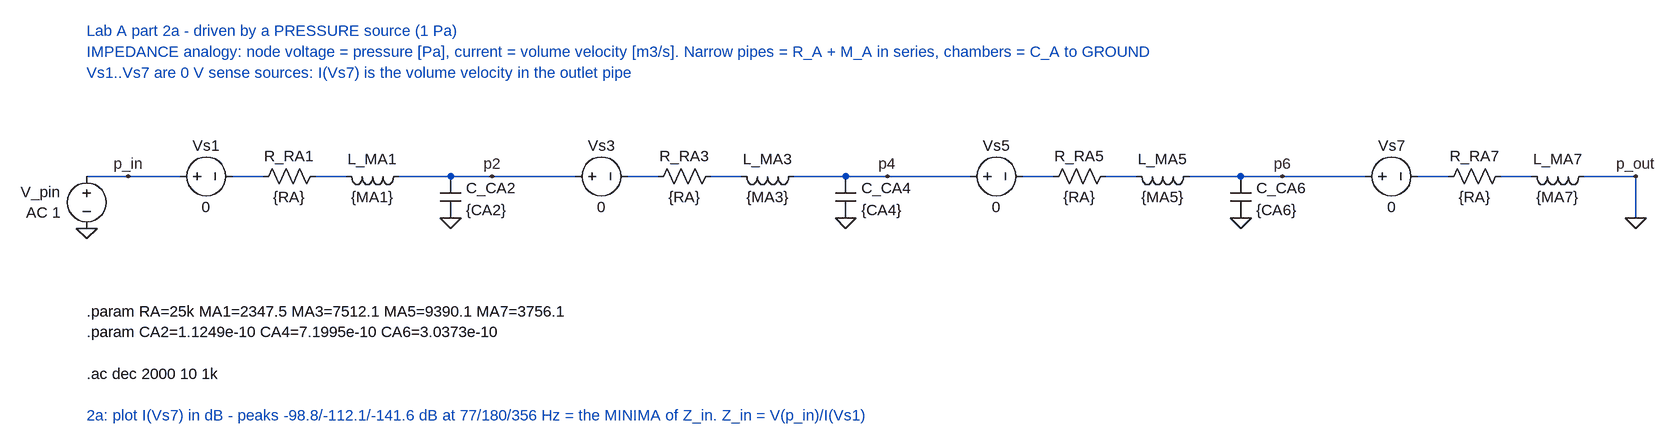
[diagram p0: schematic Part2a_Silencer_PressureSource.asc]
Part2a_Silencer_PressureSource.asc, the LTspice schematic file:
Version 4
SHEET 1 3000 1600
WIRE 0 0 144 0
WIRE 224 0 272 0
WIRE 352 0 400 0
WIRE 480 0 752 0
WIRE 832 0 880 0
WIRE 960 0 1008 0
WIRE 1088 0 1360 0
WIRE 1440 0 1488 0
WIRE 1568 0 1616 0
WIRE 1696 0 1968 0
WIRE 2048 0 2096 0
WIRE 2176 0 2224 0
WIRE 2304 0 2384 0
WIRE 2384 0 2384 64
FLAG 0 80 0
FLAG 64 0 p_in
FLAG 560 64 0
FLAG 624 0 p2
FLAG 1168 64 0
FLAG 1232 0 p4
FLAG 1776 64 0
FLAG 1840 0 p6
FLAG 2384 0 p_out
FLAG 2384 64 0
SYMBOL voltage 0 -16 R0
WINDOW 0 -40 40 Right 2
WINDOW 3 -40 72 Right 2
SYMATTR InstName V_pin
SYMATTR Value AC 1
SYMBOL voltage 128 0 R270
WINDOW 0 32 56 VTop 2
WINDOW 3 -32 56 VBottom 2
SYMATTR InstName Vs1
SYMATTR Value 0
SYMBOL res 368 -16 R90
WINDOW 0 0 56 VBottom 2
WINDOW 3 32 56 VTop 2
SYMATTR InstName R_RA1
SYMATTR Value {RA}
SYMBOL ind 496 -16 R90
WINDOW 0 5 56 VBottom 2
WINDOW 3 32 56 VTop 2
SYMATTR InstName L_MA1
SYMATTR Value {MA1}
SYMATTR SpiceLine Rser=0
SYMBOL cap 544 0 R0
WINDOW 0 40 18 Left 2
WINDOW 3 40 52 Left 2
SYMATTR InstName C_CA2
SYMATTR Value {CA2}
SYMBOL voltage 736 0 R270
WINDOW 0 32 56 VTop 2
WINDOW 3 -32 56 VBottom 2
SYMATTR InstName Vs3
SYMATTR Value 0
SYMBOL res 976 -16 R90
WINDOW 0 0 56 VBottom 2
WINDOW 3 32 56 VTop 2
SYMATTR InstName R_RA3
SYMATTR Value {RA}
SYMBOL ind 1104 -16 R90
WINDOW 0 5 56 VBottom 2
WINDOW 3 32 56 VTop 2
SYMATTR InstName L_MA3
SYMATTR Value {MA3}
SYMATTR SpiceLine Rser=0
SYMBOL cap 1152 0 R0
WINDOW 0 40 18 Left 2
WINDOW 3 40 52 Left 2
SYMATTR InstName C_CA4
SYMATTR Value {CA4}
SYMBOL voltage 1344 0 R270
WINDOW 0 32 56 VTop 2
WINDOW 3 -32 56 VBottom 2
SYMATTR InstName Vs5
SYMATTR Value 0
SYMBOL res 1584 -16 R90
WINDOW 0 0 56 VBottom 2
WINDOW 3 32 56 VTop 2
SYMATTR InstName R_RA5
SYMATTR Value {RA}
SYMBOL ind 1712 -16 R90
WINDOW 0 5 56 VBottom 2
WINDOW 3 32 56 VTop 2
SYMATTR InstName L_MA5
SYMATTR Value {MA5}
SYMATTR SpiceLine Rser=0
SYMBOL cap 1760 0 R0
WINDOW 0 40 18 Left 2
WINDOW 3 40 52 Left 2
SYMATTR InstName C_CA6
SYMATTR Value {CA6}
SYMBOL voltage 1952 0 R270
WINDOW 0 32 56 VTop 2
WINDOW 3 -32 56 VBottom 2
SYMATTR InstName Vs7
SYMATTR Value 0
SYMBOL res 2192 -16 R90
WINDOW 0 0 56 VBottom 2
WINDOW 3 32 56 VTop 2
SYMATTR InstName R_RA7
SYMATTR Value {RA}
SYMBOL ind 2320 -16 R90
WINDOW 0 5 56 VBottom 2
WINDOW 3 32 56 VTop 2
SYMATTR InstName L_MA7
SYMATTR Value {MA7}
SYMATTR SpiceLine Rser=0
TEXT 0 -224 Left 2 ;Lab A part 2a - driven by a PRESSURE source (1 Pa)
TEXT 0 -192 Left 2 ;IMPEDANCE analogy: node voltage = pressure [Pa], current = volume velocity [m3/s]. Narrow pipes = R_A + M_A in series, chambers = C_A to GROUND
TEXT 0 -160 Left 2 ;Vs1..Vs7 are 0 V sense sources: I(Vs7) is the volume velocity in the outlet pipe
TEXT 0 208 Left 2 !.param RA=25k MA1=2347.5 MA3=7512.1 MA5=9390.1 MA7=3756.1\n.param CA2=1.1249e-10 CA4=7.1995e-10 CA6=3.0373e-10
TEXT 0 304 Left 2 !.ac dec 2000 10 1k
TEXT 0 368 Left 2 ;2a: plot I(Vs7) in dB - peaks -98.8/-112.1/-141.6 dB at 77/180/356 Hz = the MINIMA of Z_in. Z_in = V(p_in)/I(Vs1)

The netlist it stands for:
* Part2a_Silencer_PressureSource.asc
V_pin p_in 0 AC 1
Vs1 p_in N001 0
R_RA1 N002 N001 {RA}
L_MA1 p2 N002 {MA1} Rser=0
C_CA2 p2 0 {CA2}
Vs3 p2 N003 0
R_RA3 N004 N003 {RA}
L_MA3 p4 N004 {MA3} Rser=0
C_CA4 p4 0 {CA4}
Vs5 p4 N005 0
R_RA5 N006 N005 {RA}
L_MA5 p6 N006 {MA5} Rser=0
C_CA6 p6 0 {CA6}
Vs7 p6 N007 0
R_RA7 N008 N007 {RA}
L_MA7 0 N008 {MA7} Rser=0
* Lab A part 2a - driven by a PRESSURE source (1 Pa)
* IMPEDANCE analogy: node voltage = pressure [Pa], current = volume velocity [m3/s]. Narrow pipes = R_A + M_A in series, chambers = C_A to GROUND
* Vs1..Vs7 are 0 V sense sources: I(Vs7) is the volume velocity in the outlet pipe
.param RA=25k MA1=2347.5 MA3=7512.1 MA5=9390.1 MA7=3756.1
.param CA2=1.1249e-10 CA4=7.1995e-10 CA6=3.0373e-10
.ac dec 2000 10 1k
* 2a: plot I(Vs7) in dB - peaks -98.8/-112.1/-141.6 dB at 77/180/356 Hz = the MINIMA of Z_in. Z_in = V(p_in)/I(Vs1)
.backanno
.end